# Altium schematic sheet GTU系统框图V1.1-20160516.SCHDOC
size A3
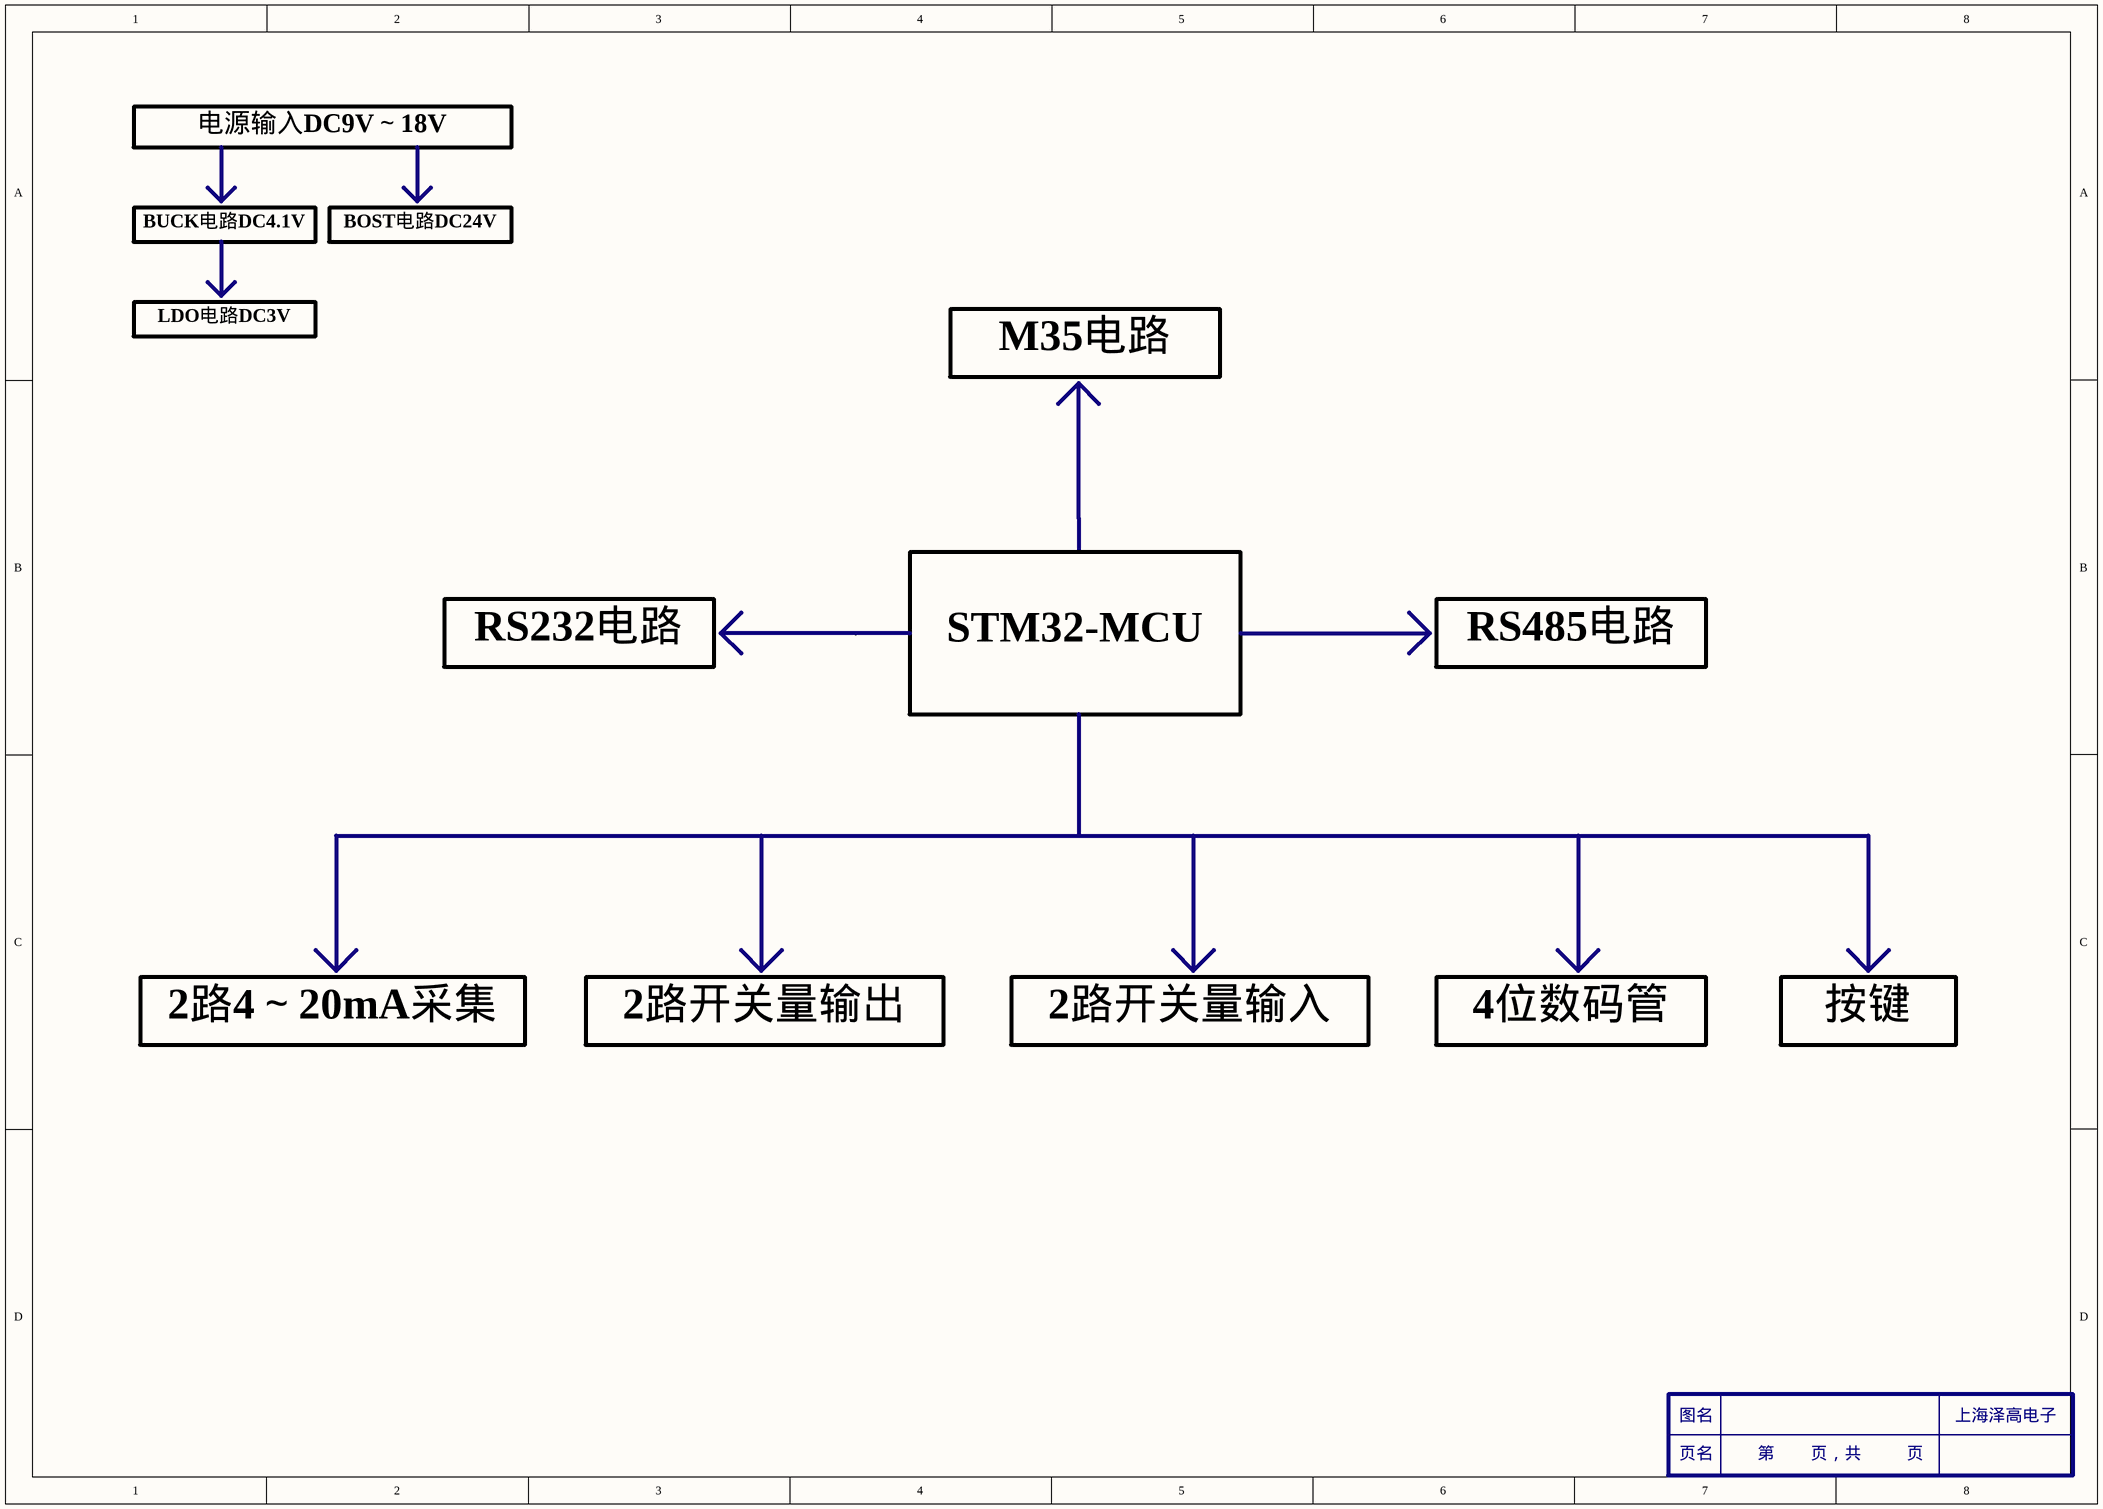
[diagram p0: GTU系统框图V1.1-20160516.SCHDOC]

## Parts
2  Component_1  (value not drawn)

## Notes on the sheet
- 电源输入DC9V～18V
- BUCK电路DC4.1V
- BOST电路DC24V
- LDO电路DC3V
- M35电路
- RS232电路
- STM32-MCU
- RS485电路
- 2路4～20mA采集
- 2路开关量输出
- 2路开关量输入
- 4位数码管
- 按键
- (in symbol Component_1) 图名; 上海泽高电子; 页名; 第        页，共          页